# EAGLE design ME6408_Central_CTRL (EAGLE 7.2.0)

## Sheet 1 of 2
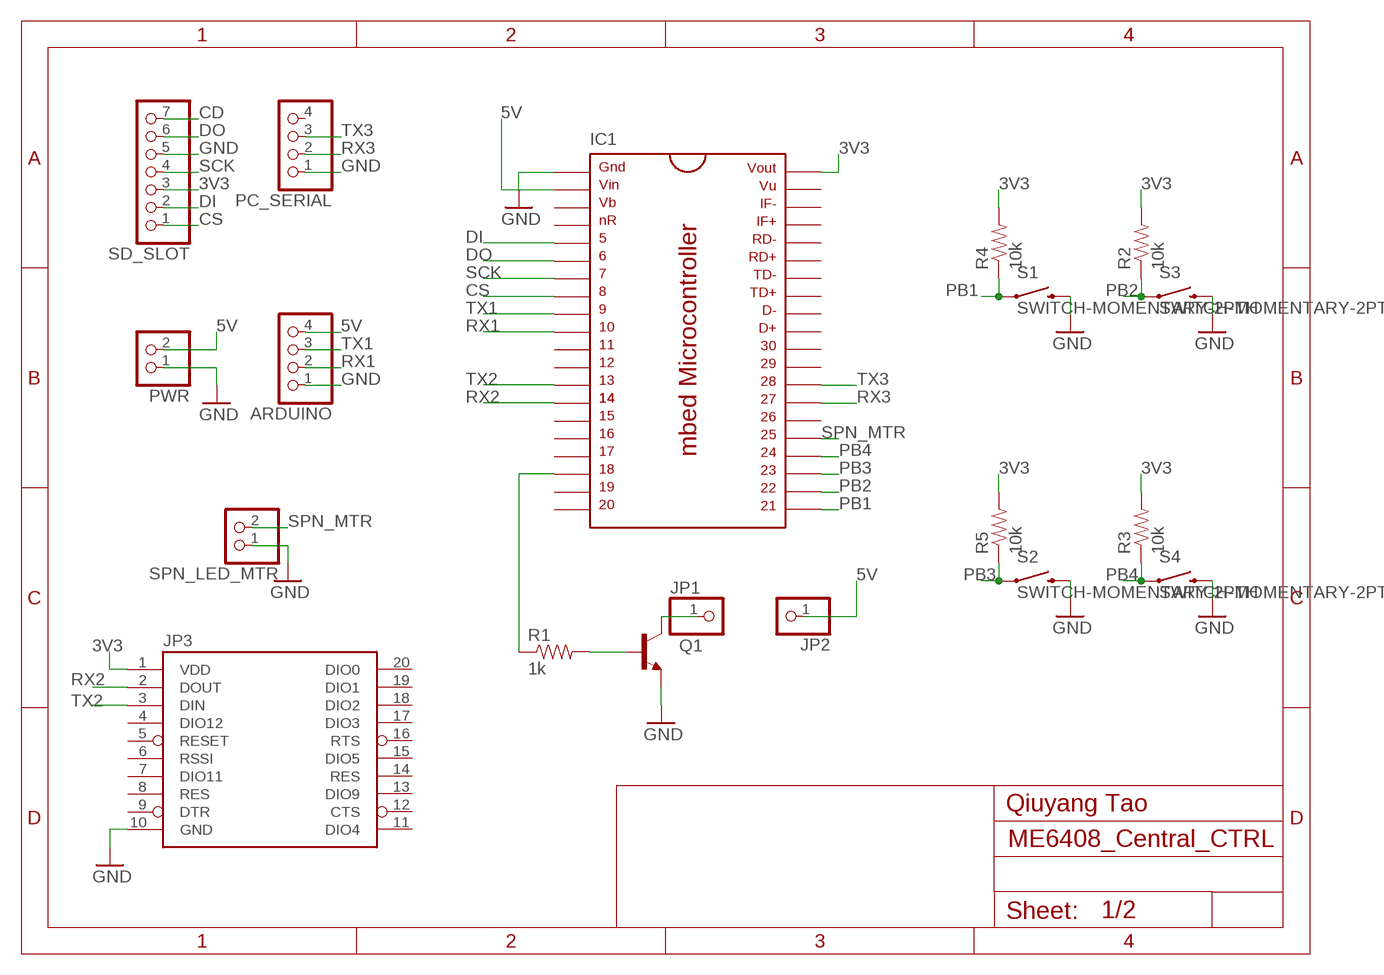
[diagram p0: schematic, sheet 1]

### Parts
ARDUINO  PINHD-1X4  [1X04]
IC1  MBED_MICROCONTROLLER  [DIL40_0.9]
JP1  PINHD-1X1  [1X01]
JP2  PINHD-1X1  [1X01]
JP3  XBEE-1B1  [XBEE-1]
PC_SERIAL  PINHD-1X4  [1X04]
PWR  PINHD-1X2  [1X02]
Q1  TRANSISTOR_NPNTO-92-AMMO  [TO-92-AMMO]
R1  1k  RESISTORAXIAL-0.3  [AXIAL-0.3]
R2  10k  RESISTORAXIAL-0.3  [AXIAL-0.3]
R3  10k  RESISTORAXIAL-0.3  [AXIAL-0.3]
R4  10k  RESISTORAXIAL-0.3  [AXIAL-0.3]
R5  10k  RESISTORAXIAL-0.3  [AXIAL-0.3]
S1  SWITCH-MOMENTARY-2PTH  [TACTILE-PTH]
S2  SWITCH-MOMENTARY-2PTH  [TACTILE-PTH]
S3  SWITCH-MOMENTARY-2PTH  [TACTILE-PTH]
S4  SWITCH-MOMENTARY-2PTH  [TACTILE-PTH]
SD_SLOT  PINHD-1X7  [1X07]
SPN_LED_MTR  PINHD-1X2  [1X02]

### Nets
3V3: IC1.40 JP3.1(VDD) R2.P$2 R3.P$2 R4.P$2 R5.P$2 SD_SLOT.3
5V: ARDUINO.4 IC1.2 JP2.1 PWR.2
CD: SD_SLOT.7
CS: IC1.8 SD_SLOT.1
DI: IC1.5 SD_SLOT.2
DO: IC1.6 SD_SLOT.6
GND: ARDUINO.1 IC1.1 JP3.10(GND) PC_SERIAL.1 PWR.1 Q1.1(E) S1.3 S2.3 S3.3 S4.3 SD_SLOT.5 SPN_LED_MTR.1
N$1: Q1.2(B) R1.P$2
N$2: JP1.1 Q1.3(C)
N$11: IC1.18 R1.P$1
PB1: IC1.21 R4.P$1 S1.1
PB2: IC1.22 R2.P$1 S3.1
PB3: IC1.23 R5.P$1 S2.1
PB4: IC1.24 R3.P$1 S4.1
RX1: ARDUINO.2 IC1.10
RX2: IC1.14 JP3.2(DOUT)
RX3: IC1.27 PC_SERIAL.2
SCK: IC1.7 SD_SLOT.4
SPN_MTR: IC1.25 SPN_LED_MTR.2
TX1: ARDUINO.3 IC1.9
TX2: IC1.13 JP3.3(DIN)
TX3: IC1.28 PC_SERIAL.3
Unconnected: IC1.3 IC1.4 IC1.11 IC1.12 IC1.15 IC1.16 IC1.17 IC1.19 IC1.20 IC1.26 IC1.29 IC1.30 IC1.31 IC1.32 IC1.33 IC1.34 IC1.35 IC1.36 IC1.37 IC1.38 IC1.39 JP3.4(DIO12) JP3.5(RESET) JP3.6(RSSI) JP3.7(DIO11) JP3.8(RES) JP3.9(DTR) JP3.11(DIO4) JP3.12(CTS) JP3.13(DIO9) JP3.14(RES) JP3.15(DIO5) JP3.16(RTS) JP3.17(DIO3) JP3.18(DIO2) JP3.19(DIO1) JP3.20(DIO0) PC_SERIAL.4

### Notes on the sheet
- Qiuyang Tao

## Sheet 2 of 2

## Library data of the parts
ARDUINO PC_SERIAL = pinhead:PINHD-1X4: PIN HEADER
IC1 = mbed-microcontroller:MBED_MICROCONTROLLER: mbed Microcontroller, DIP40, 0.9"
JP1 JP2 = pinhead:PINHD-1X1: PIN HEADER
JP3 = SparkFun-RF:XBEE-1: Xbee module footprints
PWR SPN_LED_MTR = pinhead:PINHD-1X2: PIN HEADER
Q1 = SparkFun-DiscreteSemi:TRANSISTOR_NPN: Generic NPN BJT MMBT2222A - TRANS-08049 (SOT-23, 1A 40V) MPSA42 - TRANS-09116 (SOT-23, 500mA 300V) MMBT5088LT1G - TRANS-11160 (SOT-23, 50 mA 30V) BC547 - COM-08928 <http://www.sparkfun.com/products/8928> (TO-92 45V 100mA) (1.Collector 2.Base 3.Emitter) 2N3904 - COM-00521 <http://www.sparkfun.com/products/521> (TO-92 40V 200mA) (1.Emitter 2.Base 3.Collector) P2N2222A - COM-12852 <http://www.sparkfun.com/products/12852> (TO-92 40V 600mA) (1.Collector 2.Base 3.Emitter)
R1-R5 = SparkFun-Resistors:RESISTOR: Resistor Basic schematic elements and footprints for 0603, 1206, and PTH resistors.
S1-S4 = SparkFun-Electromechanical:SWITCH-MOMENTARY-2: Various NO switches- pushbuttons, reed, etc; PROD_ID: SWCH-08441
SD_SLOT = pinhead:PINHD-1X7: PIN HEADER

## Board
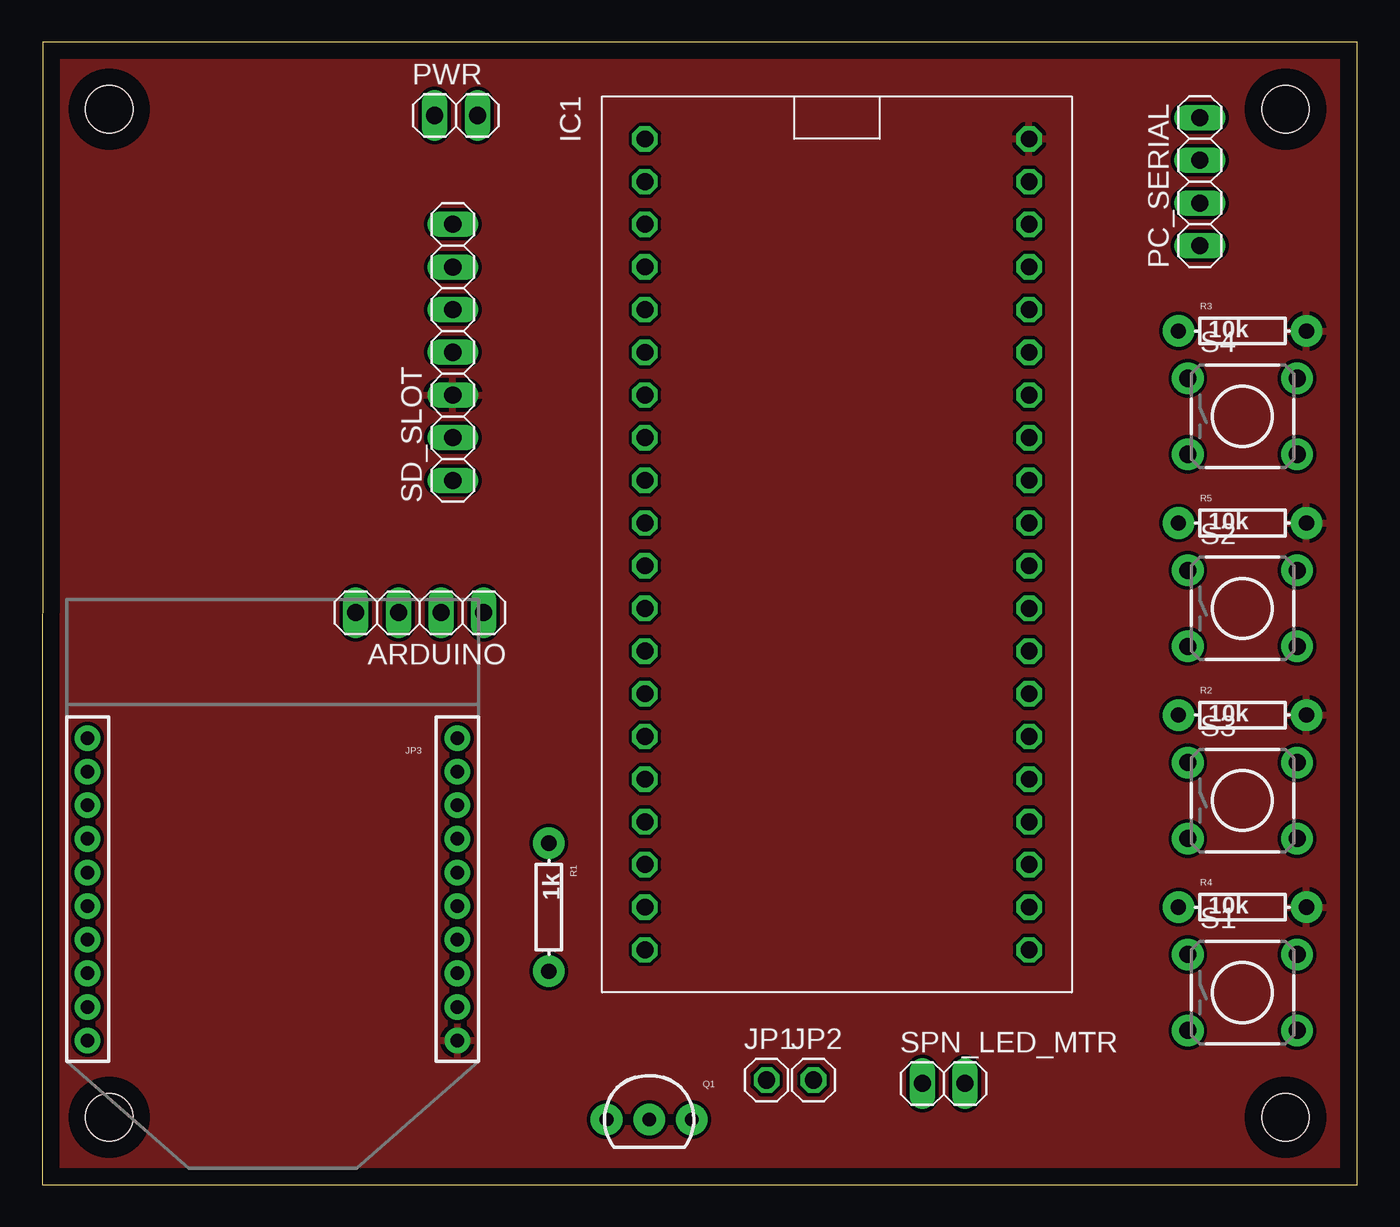
[diagram p1: board, top side]
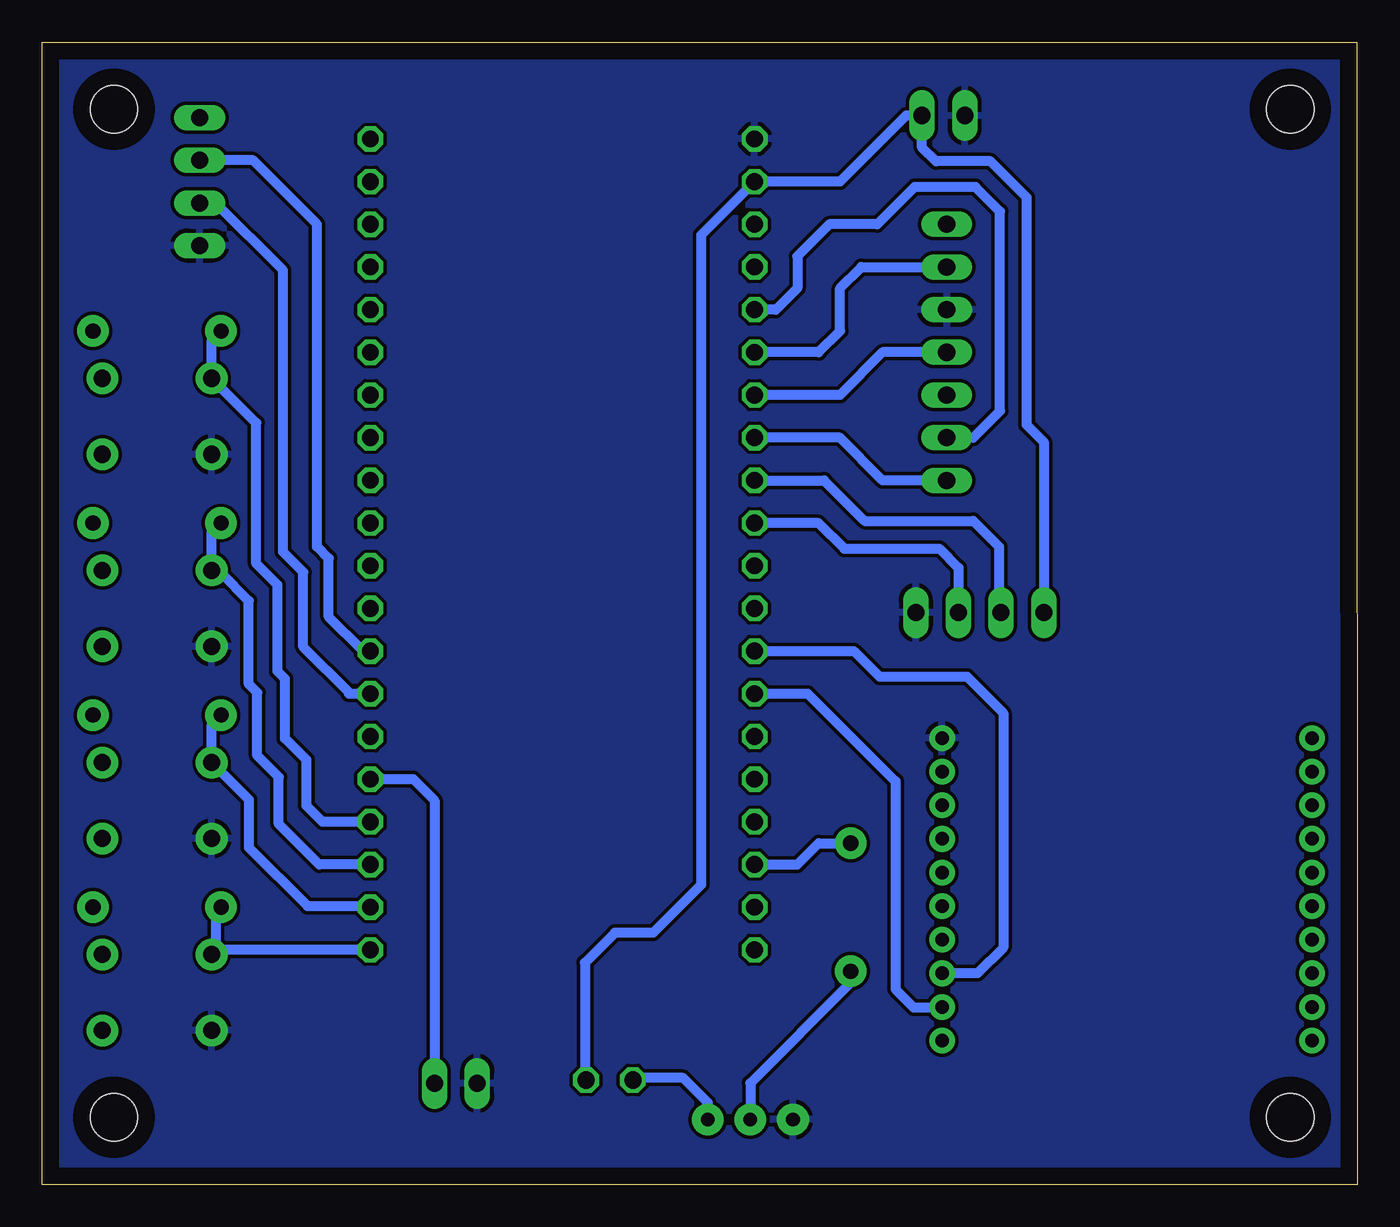
[diagram p2: board, bottom side, seen from below]

Size 78.28 x 68 mm. Coordinates in mm from the lower left corner, seen from the top.
Outline: 0,0 78.28,0 78.28,68 0.04,68 0,0
Copper layers (1*16): Top 0.035mm / dielectric 1.5mm / Bottom 0.035mm
Design rules "default": minimum track width 10mil, minimum drill 24mil, track to track 8mil, track to pad 8mil, pad to pad 8mil, via to via 8mil, smd to smd 8mil, copper to edge 40mil, drill to drill 8mil, minimum pad ring 10mil, minimum via ring 8mil, stop-mask expansion 4mil, vias tented up to drill 0mil, thermal gap 10mil
Holes 2.8 mm at 4,64 4,4 74,4 74,64

### Footprints (pad centres in the part's own frame; a part is rotated, then mirrored left to right if it is on the bottom)
1X04 = drill 1.016 long: 1 -3.81,0; 2 -1.27,0; 3 1.27,0; 4 3.81,0
DIL40_0.9 = drill 1 pad 1.397 octagon: 1 -22.86,-11.43; 2 -20.32,-11.43; 3 -17.78,-11.43; 4 -15.24,-11.43; 5 -12.7,-11.43; 6 -10.16,-11.43; 7 -7.62,-11.43; 8 -5.08,-11.43; 9 -2.54,-11.43; 10 0,-11.43; 11 2.54,-11.43; 12 5.08,-11.43; 13 7.62,-11.43; 14 10.16,-11.43; 15 12.7,-11.43; 16 15.24,-11.43; 17 17.78,-11.43; 18 20.32,-11.43; 19 22.86,-11.43; 20 25.4,-11.43; 21 25.4,11.43; 22 22.86,11.43; 23 20.32,11.43; 24 17.78,11.43; 25 15.24,11.43; 26 12.7,11.43; 27 10.16,11.43; 28 7.62,11.43; 29 5.08,11.43; 30 2.54,11.43; 31 0,11.43; 32 -2.54,11.43; 33 -5.08,11.43; 34 -7.62,11.43; 35 -10.16,11.43; 36 -12.7,11.43; 37 -15.24,11.43; 38 -17.78,11.43; 39 -20.32,11.43; 40 -22.86,11.43
1X01 = drill 1.016 octagon: 1 0,0
XBEE-1 = drill 0.8 pad 1.524: 1 -11,20; 2 -11,18; 3 -11,16; 4 -11,14; 5 -11,12; 6 -11,10; 7 -11,8; 8 -11,6; 9 -11,4; 10 -11,2; 11 11,2; 12 11,4; 13 11,6; 14 11,8; 15 11,10; 16 11,12; 17 11,14; 18 11,16; 19 11,18; 20 11,20
1X02 = drill 1.016 long: 1 -1.27,0; 2 1.27,0
TO-92-AMMO = drill 0.813 pad 1.88: 1 -2.54,0; 2 0,0; 3 2.54,0
AXIAL-0.3 = drill 0.9 pad 1.88: P$1 -3.81,0; P$2 3.81,0
TACTILE-PTH = drill 1.016 pad 1.88: 1 -3.251,2.261; 2 3.251,2.261; 3 -3.251,-2.261; 4 3.251,-2.261
1X07 = drill 1.016 long: 1 -7.62,0; 2 -5.08,0; 3 -2.54,0; 4 0,0; 5 2.54,0; 6 5.08,0; 7 7.62,0

### Placement (x,y rotation side)
ARDUINO  22.48,34.04 180 top
IC1  47.31,39.37 270 top
JP1  43.12,6.22 0 top
JP2  45.91,6.22 0 top
JP3  13.72,28.57 180 top
PC_SERIAL  68.9,59.69 90 top
PWR  24.64,63.63 0 top
Q1  36.13,3.87 0 top
R1  30.16,16.51 270 top
R2  71.44,27.94 0 top
R3  71.44,50.8 0 top
R4  71.44,16.51 0 top
R5  71.44,39.37 0 top
S1  71.44,11.43 0 top
S2  71.44,34.29 0 top
S3  71.44,22.86 0 top
S4  71.44,45.72 0 top
SD_SLOT  24.45,49.53 90 top
SPN_LED_MTR  53.66,6.02 0 top

### Tracks (layer width: path | path; a pad name or v marks a point on that pad's centre or on a via)
3V3
  pour Top: 7.94,71.12 81.6,71.12 81.53,-1.97 -0.13,-2.22 -0.25,71.25
5V
  Bottom 0.61: ARDUINO.4 18.67,44.2 19.68,45.21 19.68,58.74 21.84,60.9 25.08,60.9 25.91,61.72 PWR.2 26.86,63.63 30.8,59.69 IC1.2 39.05,56.52 39.05,17.84 41.91,14.99 44.2,14.99 45.97,13.21 45.97,6.29 JP2.1
CS
  Bottom 0.61: SD_SLOT.1 28.26,41.91 30.8,44.45 IC1.8
DI
  Bottom 0.61: 23.18,44.45 SD_SLOT.2 22.86,44.45 21.27,46.04 21.27,57.91 22.73,59.37 26.35,59.37 28.57,57.15 31.43,57.15 33.34,55.24 33.34,53.34 34.61,52.07 IC1.5
DO
  Bottom 0.61: IC1.6 32.07,49.53 30.8,50.8 30.8,53.34 29.53,54.61 SD_SLOT.6
GND
  pour Bottom: -0.25,68.58 79.06,68.58 78.93,-1.97 -0.25,-2.22
N$1
  Bottom 0.61: Q1.2 36.13,6.03 30.16,12 R1.P$2
N$2
  Bottom 0.61: Q1.3 38.67,4.89 40.13,6.35 42.99,6.35 JP1.1
N$11
  Bottom 0.61: IC1.18 33.34,19.05 32.07,20.32 R1.P$1
PB1
  Bottom 0.61: IC1.21 67.91,13.97 | 67.91,13.97 S1.1 | 67.91,13.97 67.91,16.23 R4.P$1
PB2
  Bottom 0.61: R2.P$1 68.19,27.38 S3.1 65.98,22.91 65.98,20.07 62.48,16.57 58.8,16.57 IC1.22
PB3
  Bottom 0.61: R5.P$1 68.2,38.8 68.2,36.32 68.19,36.34 S2.1 68.02,36.39 67.63,36.39 65.98,34.73 65.98,29.78 65.47,29.27 65.47,25.53 64.2,24.26 64.2,21.46 61.78,19.05 IC1.23
PB4
  Bottom 0.61: R3.P$1 68.19,50.24 S4.1 65.53,45.33 65.53,36.96 64.26,35.69 64.26,30.54 63.82,30.1 63.82,26.54 62.55,25.27 62.55,22.54 61.59,21.59 IC1.24
RX1
  Bottom 0.61: IC1.10 32.07,39.37 30.54,37.85 24.89,37.85 23.75,36.7 ARDUINO.2
RX2
  Bottom 0.61: IC1.14 32.7,29.21 27.5,24 27.5,11.62 26.42,10.54 24.75,10.54 JP3.2
RX3
  Bottom 0.61: IC1.27 60.01,29.21 60.01,29.27 62.74,32 62.74,36.45 63.94,37.66 63.94,54.42 67.94,58.42 PC_SERIAL.2
SCK
  Bottom 0.61: SD_SLOT.4 28.26,49.53 30.8,46.99 IC1.7
SPN_MTR
  Bottom 0.61: IC1.25 56.2,24.13 54.93,22.86 SPN_LED_MTR.2
TX1
  Bottom 0.61: IC1.9 31.75,41.91 29.34,39.5 22.86,39.5 21.34,37.97 21.34,34.16 ARDUINO.3
TX2
  Bottom 0.61: IC1.13 29.97,31.75 28.45,30.23 23.24,30.23 21.08,28.07 21.08,14.1 22.61,12.57 JP3.3
TX3
  Bottom 0.61: PC_SERIAL.3 65.72,60.96 61.91,57.15 61.91,37.97 61.21,37.27 61.21,33.78 59.18,31.75 IC1.28